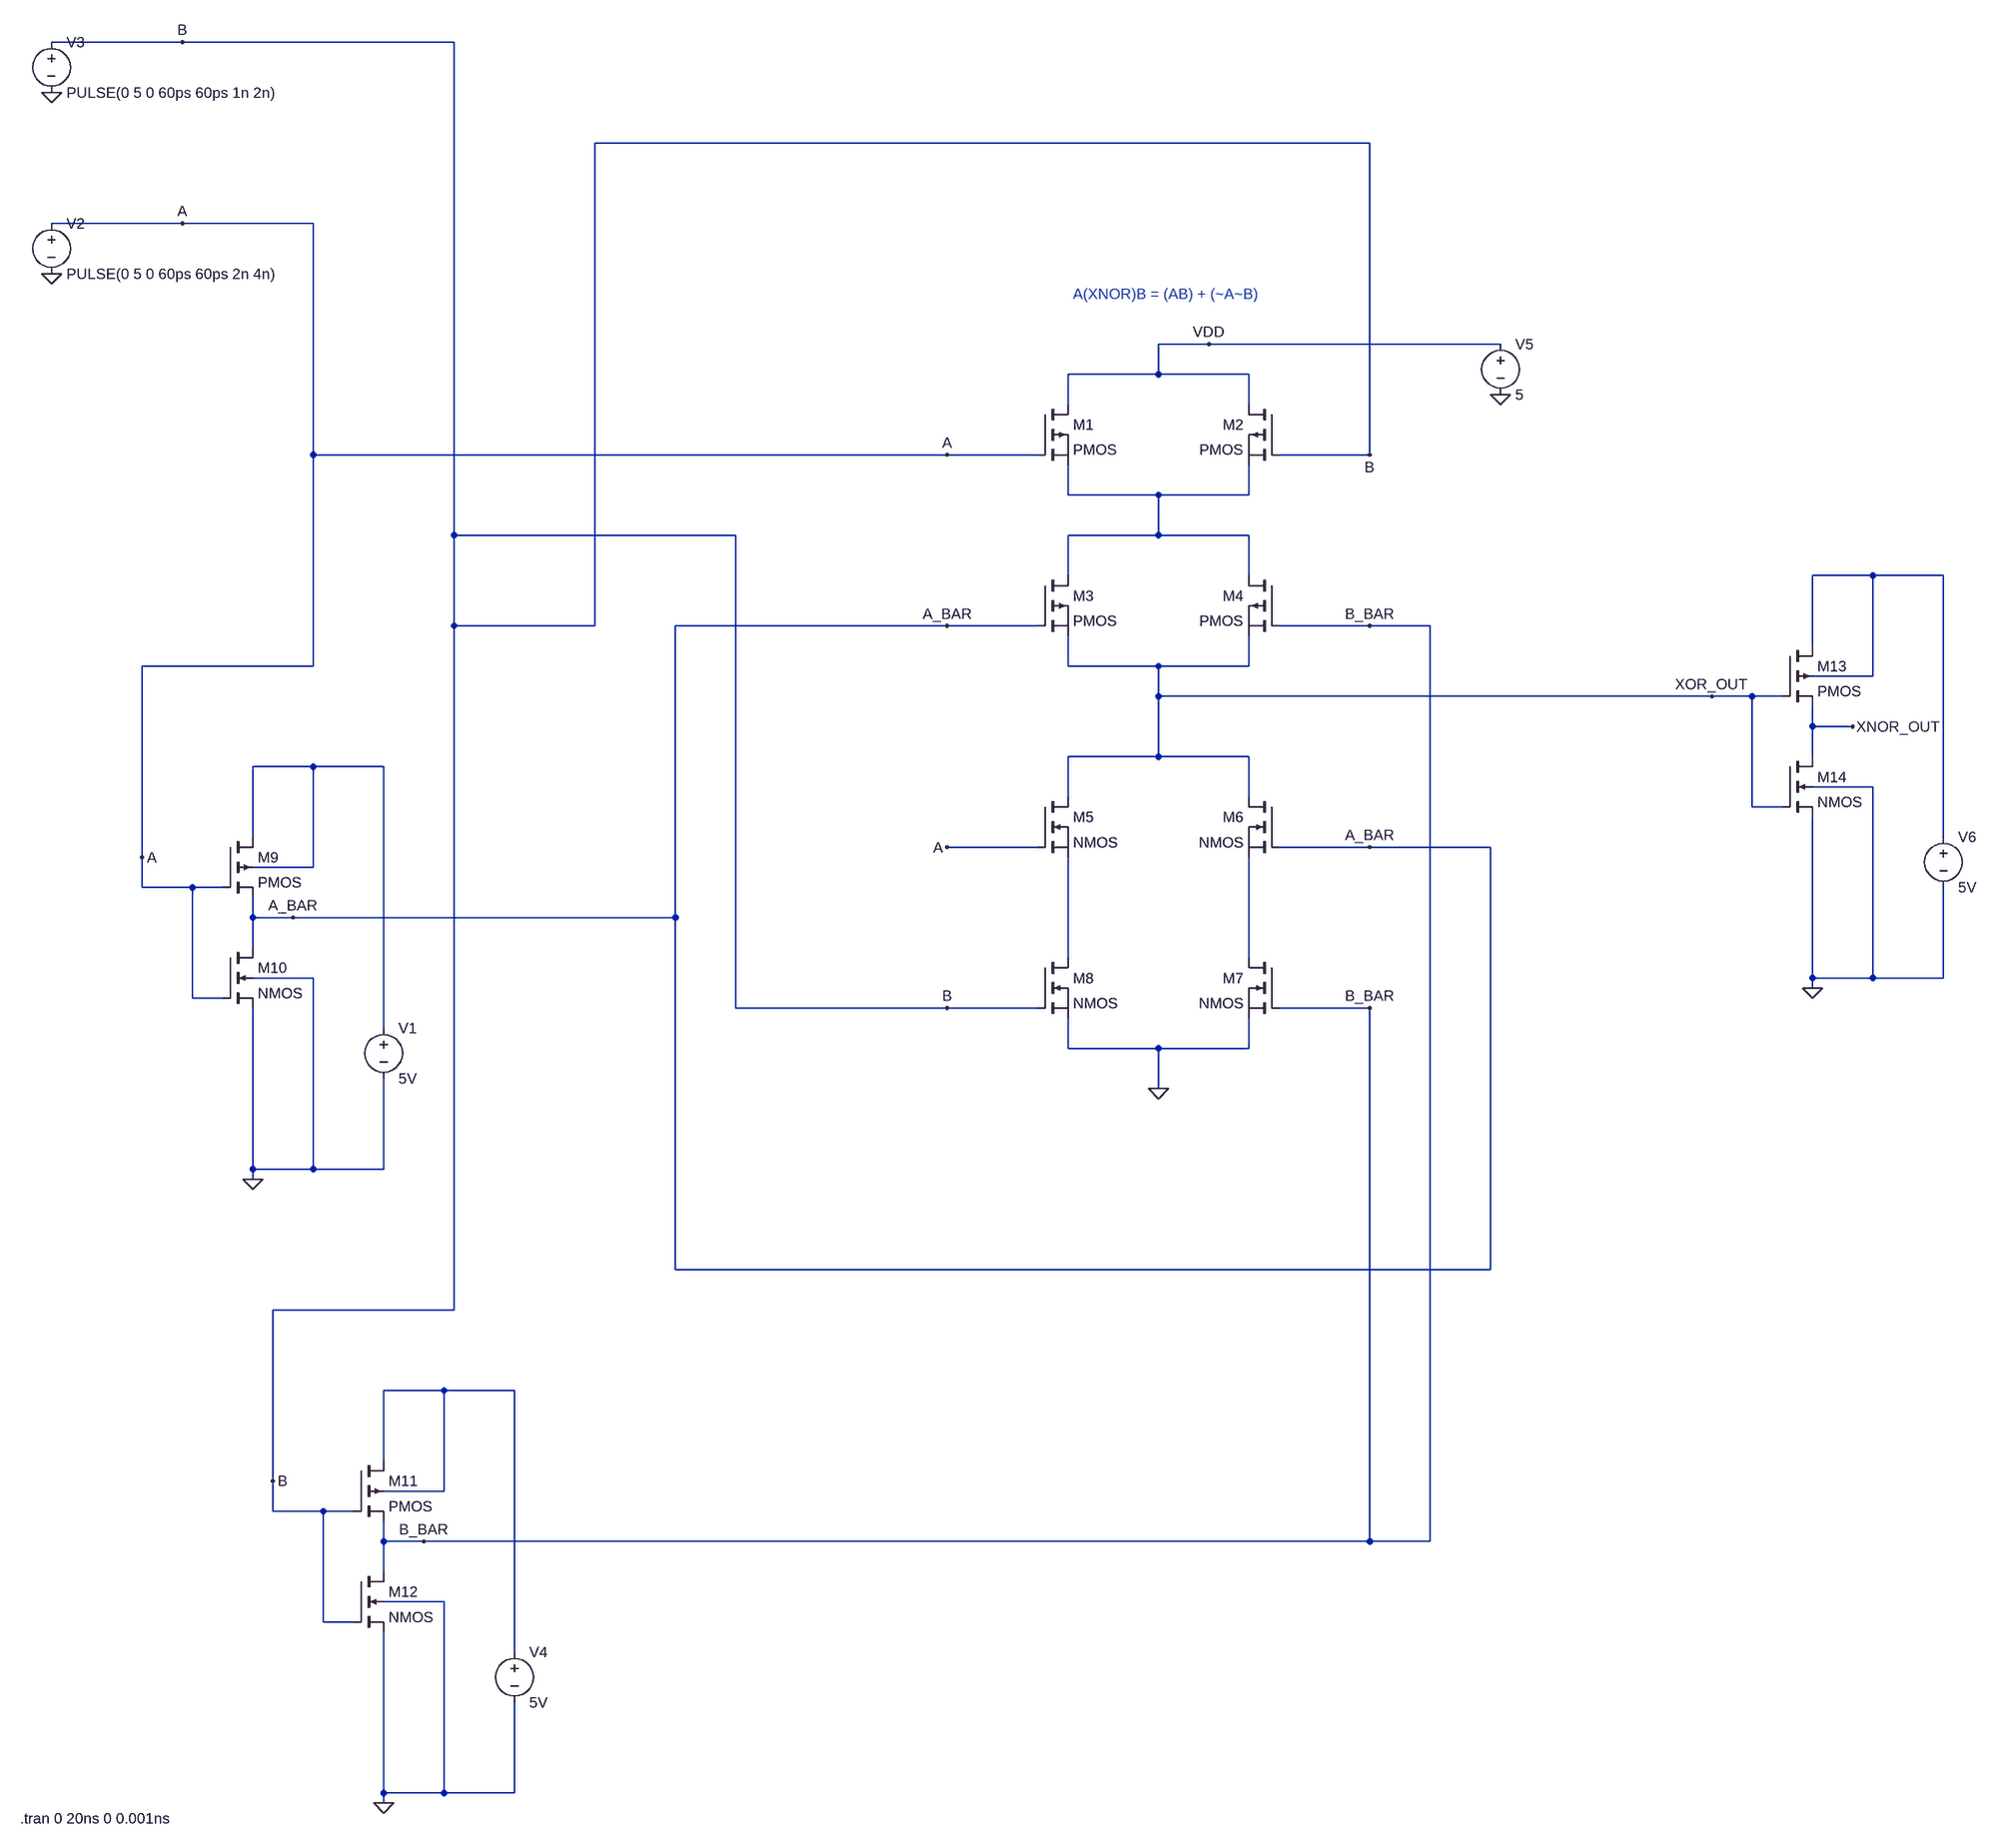
[diagram p0: schematic XNOR.asc]
XNOR.asc, the LTspice schematic file:
Version 4
SHEET 1 2568 1572
WIRE -288 -1472 -496 -1472
WIRE 144 -1472 -288 -1472
WIRE 1600 -1312 368 -1312
WIRE -288 -1184 -496 -1184
WIRE -80 -1184 -288 -1184
WIRE 1344 -992 1264 -992
WIRE 1808 -992 1344 -992
WIRE 1264 -944 1264 -992
WIRE 1264 -944 1120 -944
WIRE 1408 -944 1264 -944
WIRE 1120 -896 1120 -944
WIRE 1408 -896 1408 -944
WIRE -80 -816 -80 -1184
WIRE 928 -816 -80 -816
WIRE 1072 -816 928 -816
WIRE 1600 -816 1600 -1312
WIRE 1600 -816 1456 -816
WIRE 1120 -752 1120 -800
WIRE 1264 -752 1120 -752
WIRE 1408 -752 1408 -800
WIRE 1408 -752 1264 -752
WIRE 144 -688 144 -1472
WIRE 592 -688 144 -688
WIRE 1264 -688 1264 -752
WIRE 1264 -688 1120 -688
WIRE 1408 -688 1264 -688
WIRE 1120 -624 1120 -688
WIRE 1408 -624 1408 -688
WIRE 2400 -624 2304 -624
WIRE 2512 -624 2400 -624
WIRE 144 -544 144 -688
WIRE 368 -544 368 -1312
WIRE 368 -544 144 -544
WIRE 928 -544 496 -544
WIRE 1072 -544 928 -544
WIRE 1600 -544 1456 -544
WIRE 1696 -544 1600 -544
WIRE 2304 -512 2304 -624
WIRE -80 -480 -80 -816
WIRE -80 -480 -352 -480
WIRE 1120 -480 1120 -528
WIRE 1264 -480 1120 -480
WIRE 1408 -480 1408 -528
WIRE 1408 -480 1264 -480
WIRE 2400 -464 2400 -624
WIRE 2400 -464 2304 -464
WIRE 1264 -432 1264 -480
WIRE 2144 -432 1264 -432
WIRE 2208 -432 2144 -432
WIRE 2256 -432 2208 -432
WIRE 2304 -384 2304 -416
WIRE 2368 -384 2304 -384
WIRE 1264 -336 1264 -432
WIRE 1264 -336 1120 -336
WIRE 1408 -336 1264 -336
WIRE 2304 -336 2304 -384
WIRE -80 -320 -176 -320
WIRE 32 -320 -80 -320
WIRE 2400 -288 2304 -288
WIRE 1120 -272 1120 -336
WIRE 1408 -272 1408 -336
WIRE 2208 -256 2208 -432
WIRE 2256 -256 2208 -256
WIRE -176 -208 -176 -320
WIRE 2512 -208 2512 -624
WIRE 1072 -192 928 -192
WIRE 1600 -192 1456 -192
WIRE 1792 -192 1600 -192
WIRE -352 -176 -352 -480
WIRE -80 -160 -80 -320
WIRE -80 -160 -176 -160
WIRE -352 -128 -352 -176
WIRE -272 -128 -352 -128
WIRE -224 -128 -272 -128
WIRE -176 -80 -176 -112
WIRE -112 -80 -176 -80
WIRE 496 -80 496 -544
WIRE 496 -80 -112 -80
WIRE -176 -32 -176 -80
WIRE 1120 -16 1120 -176
WIRE 1408 -16 1408 -176
WIRE -80 16 -176 16
WIRE 2304 16 2304 -240
WIRE 2400 16 2400 -288
WIRE 2400 16 2304 16
WIRE 2512 16 2512 -128
WIRE 2512 16 2400 16
WIRE 2304 32 2304 16
WIRE -272 48 -272 -128
WIRE -224 48 -272 48
WIRE 592 64 592 -688
WIRE 928 64 592 64
WIRE 1072 64 928 64
WIRE 1600 64 1456 64
WIRE 32 96 32 -320
WIRE 1120 128 1120 80
WIRE 1264 128 1120 128
WIRE 1408 128 1408 80
WIRE 1408 128 1264 128
WIRE 1264 192 1264 128
WIRE -176 320 -176 64
WIRE -80 320 -80 16
WIRE -80 320 -176 320
WIRE 32 320 32 176
WIRE 32 320 -80 320
WIRE -176 336 -176 320
WIRE 496 480 496 -80
WIRE 1792 480 1792 -192
WIRE 1792 480 496 480
WIRE 144 544 144 -544
WIRE 144 544 -144 544
WIRE 128 672 32 672
WIRE 240 672 128 672
WIRE 32 784 32 672
WIRE -144 816 -144 544
WIRE 128 832 128 672
WIRE 128 832 32 832
WIRE -144 864 -144 816
WIRE -64 864 -144 864
WIRE -16 864 -64 864
WIRE 32 912 32 880
WIRE 96 912 32 912
WIRE 1600 912 1600 64
WIRE 1600 912 96 912
WIRE 1696 912 1696 -544
WIRE 1696 912 1600 912
WIRE 32 960 32 912
WIRE 128 1008 32 1008
WIRE -64 1040 -64 864
WIRE -16 1040 -64 1040
WIRE 240 1088 240 672
WIRE 32 1312 32 1056
WIRE 128 1312 128 1008
WIRE 128 1312 32 1312
WIRE 240 1312 240 1168
WIRE 240 1312 128 1312
WIRE 32 1328 32 1312
FLAG 1600 -816 B
FLAG 1344 -992 VDD
FLAG 928 -816 A
FLAG 1600 -544 B_BAR
FLAG 928 -544 A_BAR
FLAG 1264 192 0
FLAG 928 -192 A
FLAG 1600 -192 A_BAR
FLAG 928 64 B
FLAG 1600 64 B_BAR
FLAG -176 336 0
FLAG -352 -176 A
FLAG -112 -80 A_BAR
FLAG -496 -1392 0
FLAG -496 -1104 0
FLAG -288 -1472 B
FLAG -288 -1184 A
FLAG 32 1328 0
FLAG -144 816 B
FLAG 96 912 B_BAR
FLAG 1808 -912 0
FLAG 2304 32 0
FLAG 2368 -384 XNOR_OUT
FLAG 2144 -432 XOR_OUT
SYMBOL pmos 1072 -896 R0
SYMATTR InstName M1
SYMBOL pmos 1456 -896 M0
SYMATTR InstName M2
SYMBOL pmos 1072 -624 R0
SYMATTR InstName M3
SYMBOL pmos 1456 -624 M0
SYMATTR InstName M4
SYMBOL nmos 1072 -272 R0
SYMATTR InstName M5
SYMBOL nmos 1456 -272 M0
SYMATTR InstName M6
SYMBOL nmos 1456 -16 M0
SYMATTR InstName M7
SYMBOL nmos 1072 -16 R0
SYMATTR InstName M8
SYMBOL voltage 32 80 R0
WINDOW 123 0 0 Left 0
WINDOW 39 0 0 Left 0
SYMATTR InstName V1
SYMATTR Value 5V
SYMBOL pmos4 -224 -208 R0
SYMATTR InstName M9
SYMATTR Value2 l=0.6u w=6u
SYMBOL nmos4 -224 -32 R0
SYMATTR InstName M10
SYMATTR Value2 l=0.6u w=3u
SYMBOL voltage -496 -1200 R0
WINDOW 123 0 0 Left 0
WINDOW 39 0 0 Left 0
SYMATTR InstName V2
SYMATTR Value PULSE(0 5 0 60ps 60ps 2n 4n)
SYMBOL voltage -496 -1488 R0
WINDOW 123 0 0 Left 0
WINDOW 39 0 0 Left 0
SYMATTR InstName V3
SYMATTR Value PULSE(0 5 0 60ps 60ps 1n 2n)
SYMBOL voltage 240 1072 R0
WINDOW 123 0 0 Left 0
WINDOW 39 0 0 Left 0
SYMATTR InstName V4
SYMATTR Value 5V
SYMBOL pmos4 -16 784 R0
SYMATTR InstName M11
SYMATTR Value2 l=0.6u w=6u
SYMBOL nmos4 -16 960 R0
SYMATTR InstName M12
SYMATTR Value2 l=0.6u w=3u
SYMBOL voltage 1808 -1008 R0
SYMATTR InstName V5
SYMATTR Value 5
SYMBOL voltage 2512 -224 R0
WINDOW 123 0 0 Left 0
WINDOW 39 0 0 Left 0
SYMATTR InstName V6
SYMATTR Value 5V
SYMBOL pmos4 2256 -512 R0
SYMATTR InstName M13
SYMATTR Value2 l=0.6u w=6u
SYMBOL nmos4 2256 -336 R0
SYMATTR InstName M14
SYMATTR Value2 l=0.6u w=3u
TEXT 1128 -1072 Left 2 ;A(XNOR)B = (AB) + (~A~B)
TEXT -546 1352 Left 2 !.tran 0 20ns 0 0.001ns

The netlist it stands for:
* XNOR.asc
M1 VDD A N001 N001 PMOS
M2 VDD B N001 N001 PMOS
M3 N001 A_BAR XOR_OUT XOR_OUT PMOS
M4 N001 B_BAR XOR_OUT XOR_OUT PMOS
M5 XOR_OUT A N004 N004 NMOS
M6 XOR_OUT A_BAR N005 N005 NMOS
M7 N005 B_BAR 0 0 NMOS
M8 N004 B 0 0 NMOS
V1 N003 0 5V
M9 N003 A A_BAR N003 PMOS l=0.6u w=6u
M10 A_BAR A 0 0 NMOS l=0.6u w=3u
V2 A 0 PULSE(0 5 0 60ps 60ps 2n 4n)
V3 B 0 PULSE(0 5 0 60ps 60ps 1n 2n)
V4 N006 0 5V
M11 N006 B B_BAR N006 PMOS l=0.6u w=6u
M12 B_BAR B 0 0 NMOS l=0.6u w=3u
V5 VDD 0 5
V6 N002 0 5V
M13 N002 XOR_OUT XNOR_OUT N002 PMOS l=0.6u w=6u
M14 XNOR_OUT XOR_OUT 0 0 NMOS l=0.6u w=3u
.model NMOS NMOS
.model PMOS PMOS
.lib standard.mos
* A(XNOR)B = (AB) + (~A~B)
.tran 0 20ns 0 0.001ns
.backanno
.end